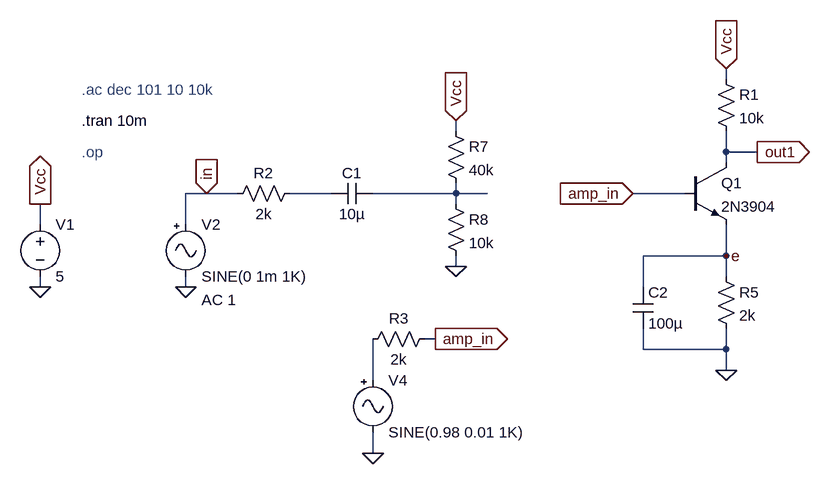
[diagram p0: schematic Amplifier_Looper_Try1.asc]
Amplifier_Looper_Try1.asc, the LTspice schematic file:
Version 4
SHEET 1 1248 680
WIRE 48 -192 48 -208
WIRE -368 -112 -368 -128
WIRE 48 -80 48 -112
WIRE 96 -80 48 -80
WIRE 48 -64 48 -80
WIRE -752 -16 -784 -16
WIRE -704 -16 -752 -16
WIRE -560 -16 -624 -16
WIRE -368 -16 -368 -32
WIRE -368 -16 -496 -16
WIRE -320 -16 -368 -16
WIRE -16 -16 -96 -16
WIRE -368 0 -368 -16
WIRE -1008 32 -1008 0
WIRE -784 32 -784 -16
WIRE 48 80 48 32
WIRE 48 80 -80 80
WIRE -368 96 -368 80
WIRE 48 112 48 80
WIRE -1008 128 -1008 112
WIRE -784 128 -784 112
WIRE -80 128 -80 80
WIRE -400 208 -416 208
WIRE -80 224 -80 192
WIRE 48 224 48 192
WIRE 48 224 -80 224
WIRE 48 256 48 224
WIRE -496 272 -496 208
WIRE -496 384 -496 352
FLAG -368 96 0
FLAG -752 -16 in
IOPIN -752 -16 In
FLAG -1008 0 Vcc
IOPIN -1008 0 Out
FLAG 96 -80 out1
IOPIN 96 -80 Out
FLAG 48 -208 Vcc
IOPIN 48 -208 In
FLAG 48 256 0
FLAG -368 -128 Vcc
IOPIN -368 -128 In
FLAG -1008 128 0
FLAG -784 128 0
FLAG -96 -16 amp_in
IOPIN -96 -16 In
FLAG 48 80 e
FLAG -496 384 0
FLAG -400 208 amp_in
IOPIN -400 208 Out
SYMBOL npn -16 -64 R0
SYMATTR InstName Q1
SYMATTR Value 2N3904
SYMBOL res 32 -208 R0
SYMATTR InstName R1
SYMATTR Value 10k
SYMBOL Misc\\signal -784 16 R0
WINDOW 123 24 132 Left 2
WINDOW 39 0 0 Left 0
SYMATTR Value2 AC 1
SYMATTR InstName V2
SYMATTR Value SINE(0 1m 1K)
SYMBOL voltage -1008 16 R0
WINDOW 123 0 0 Left 0
WINDOW 39 0 0 Left 0
SYMATTR InstName V1
SYMATTR Value 5
SYMBOL res 32 96 R0
SYMATTR InstName R5
SYMATTR Value 2k
SYMBOL res -384 -128 R0
SYMATTR InstName R7
SYMATTR Value 40k
SYMBOL res -384 -16 R0
SYMATTR InstName R8
SYMATTR Value 10k
SYMBOL res -608 -32 R90
WINDOW 0 0 56 VBottom 2
WINDOW 3 32 56 VTop 2
SYMATTR InstName R2
SYMATTR Value 2k
SYMBOL cap -96 128 R0
SYMATTR InstName C2
SYMATTR Value 100µ
SYMBOL cap -496 -32 R90
WINDOW 0 0 32 VBottom 2
WINDOW 3 32 32 VTop 2
SYMATTR InstName C1
SYMATTR Value 10µ
SYMBOL Misc\\signal -496 256 R0
WINDOW 123 0 0 Left 0
WINDOW 39 0 0 Left 0
SYMATTR InstName V4
SYMATTR Value SINE(0.98 0.01 1K)
SYMBOL res -400 192 R90
WINDOW 0 0 56 VBottom 2
WINDOW 3 32 56 VTop 2
SYMATTR InstName R3
SYMATTR Value 2k
TEXT -944 -128 Left 2 !.tran 10m
TEXT -944 -176 Left 2 ;.ac dec 101 10 10k
TEXT -944 -80 Left 2 ;.op

The netlist it stands for:
* Amplifier_Looper_Try1.asc
Q1 out1 amp_in e 0 2N3904
R1 Vcc out1 10k
V2 in 0 SINE(0 1m 1K) AC 1
V1 Vcc 0 5
R5 e 0 2k
R7 Vcc N002 40k
R8 N002 0 10k
R2 N001 in 2k
C2 e 0 100µ
C1 N002 N001 10µ
V4 N003 0 SINE(0.98 0.01 1K)
R3 amp_in N003 2k
.model NPN NPN
.model PNP PNP
.lib standard.bjt
.tran 10m
* .ac dec 101 10 10k
* .op
.backanno
.end